# EAGLE design TSOC_Block_Template_SMD (EAGLE 6.6.0)
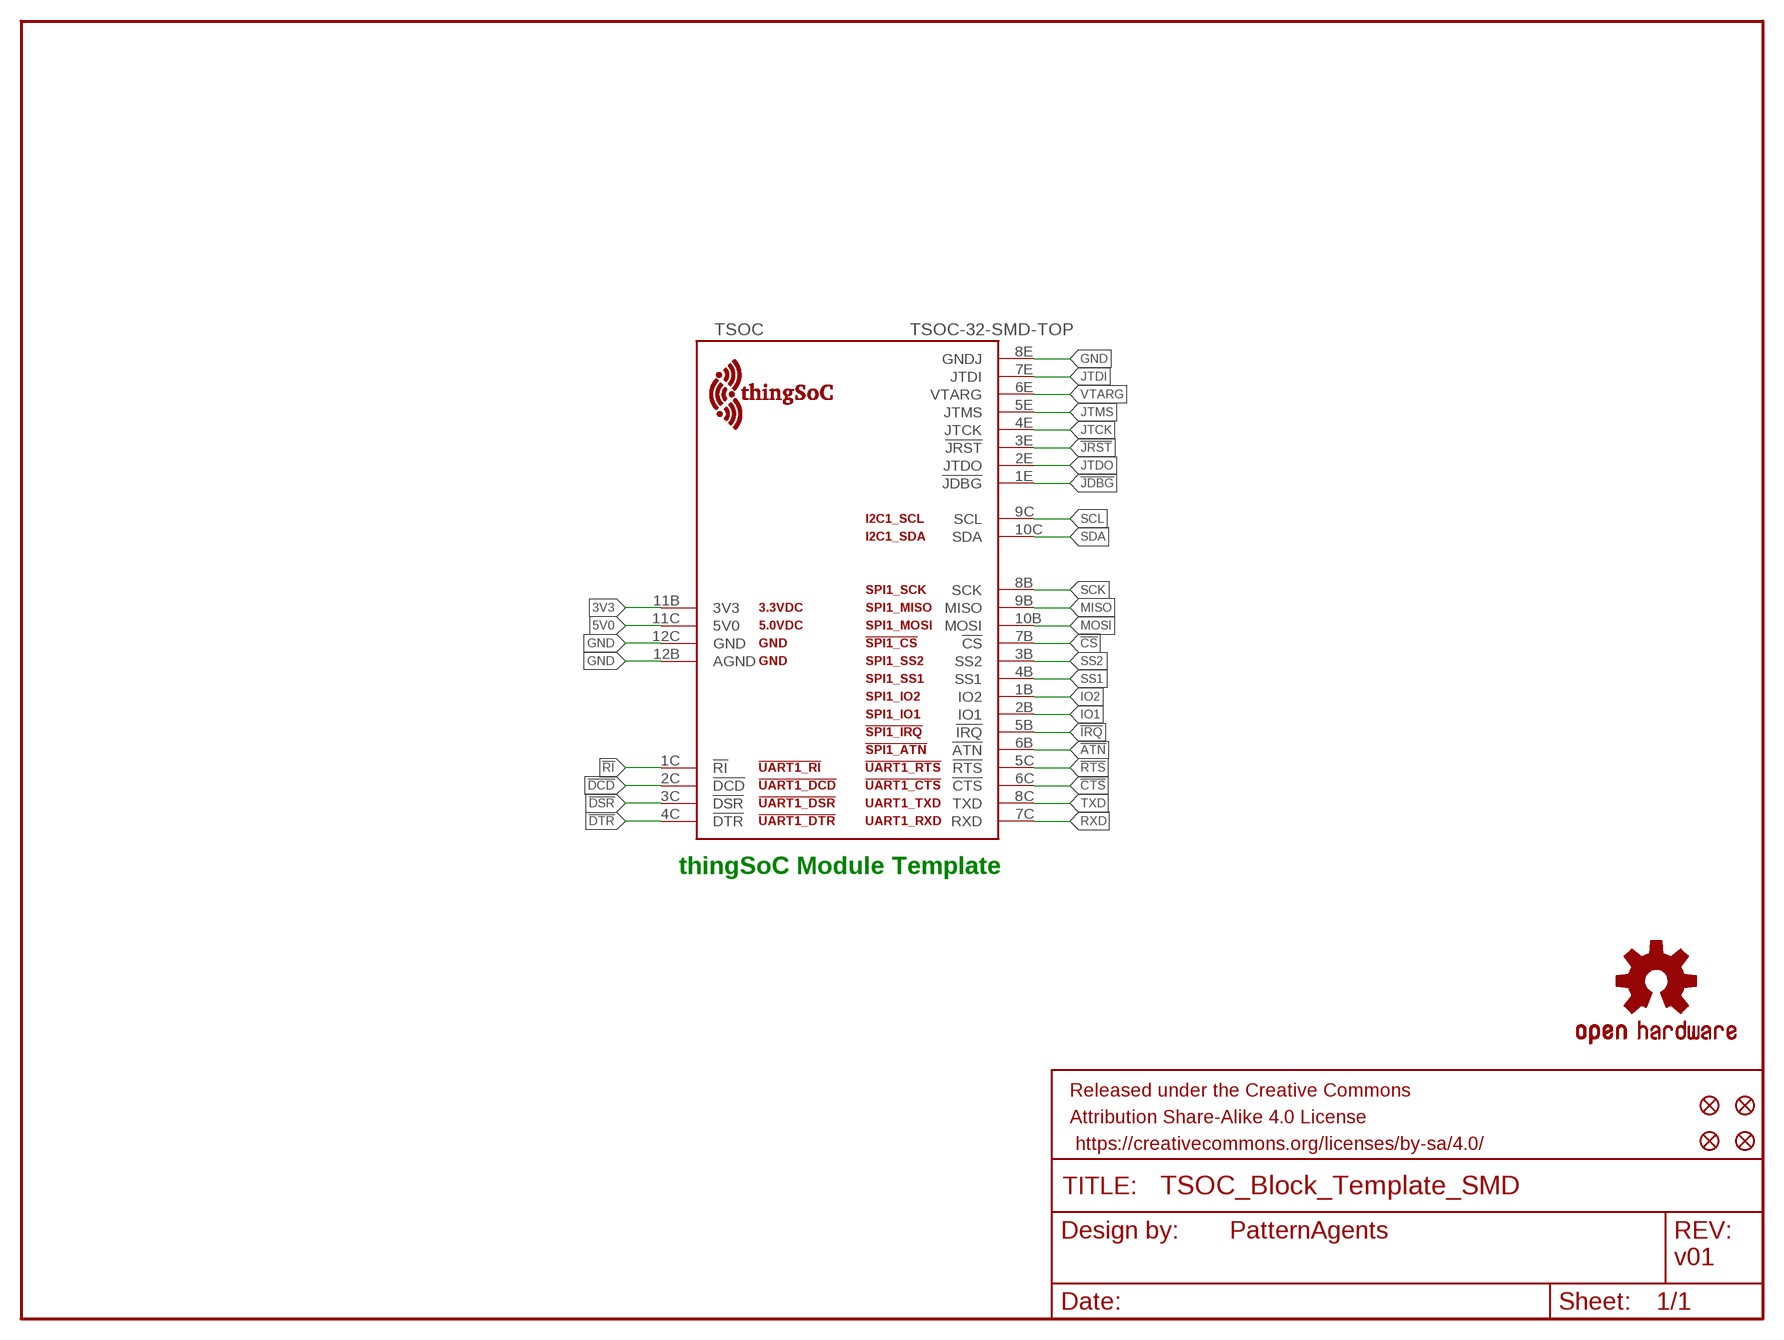
[diagram p0: schematic, sheet 1]

## Parts
FID1  FIDUCIAL1X2  [FIDUCIAL-1X2]
FID2  FIDUCIAL1X2  [FIDUCIAL-1X2]
FID3  FIDUCIAL1X2  [FIDUCIAL-1X2]
FID4  FIDUCIAL1X2  [FIDUCIAL-1X2]
FRAME1  FRAME-LETTER  [CREATIVE_COMMONS]
LOGO1  OSHW-LOGOS  [OSHW-LOGO-S]
TSOC  TSOC-32-SMD-TOP  [TSOC-BB-S32-SMD-TOP]

## Nets
3V3: TSOC.11B(3V3)
5V0: TSOC.11C(5V0)
!ATN: TSOC.6B(!ATN)
!CS: TSOC.7B(!CS)
!CTS: TSOC.6C(!CTS)
!DCD: TSOC.2C(!DCD)
!DSR: TSOC.3C(!DSR)
!DTR: TSOC.4C(!DTR)
!IRQ: TSOC.5B(!IRQ)
!JDBG: TSOC.1E(!JDBG)
!JRST: TSOC.3E(!JRST)
!RI: TSOC.1C(!RI)
!RTS: TSOC.5C(!RTS)
GND [vcc]: TSOC.8E(GNDJ) TSOC.12B(AGND) TSOC.12C(GND)
IO1: TSOC.2B(IO1)
IO2: TSOC.1B(IO2)
JTCK: TSOC.4E(JTCK)
JTDI: TSOC.7E(JTDI)
JTDO: TSOC.2E(JTDO)
JTMS: TSOC.5E(JTMS)
MISO: TSOC.9B(MISO)
MOSI: TSOC.10B(MOSI)
RXD: TSOC.7C(RXD)
SCK: TSOC.8B(SCK)
SCL: TSOC.9C(SCL)
SDA: TSOC.10C(SDA)
SS1: TSOC.4B(SS1)
SS2: TSOC.3B(SS2)
TXD: TSOC.8C(TXD)
VTARG: TSOC.6E(VTARG)

## Notes on the sheet
- thingSoC Module Template
- PatternAgents
- v01

## Library data of the parts
FID1-FID4 = SparkFun-Aesthetics:FIDUCIAL: Fiducial Alignment Points Various fiducial points for machine vision alignment.
FRAME1 = SparkFun-Aesthetics:FRAME-LETTER: Schematic Frame Standard 8.5x11 US Letter frame
LOGO1 = SparkFun-Aesthetics:OSHW-LOGO: Open Source Hardware Logo This logo indicates the piece of hardware it is found on incorporates a OSHW license and/or adheres to the definition of open source hardware found here: http://freedomdefined.org/OSHW
TSOC = thingSoC:TSOC-32: thingSoC Thirty-Two (32) Pin Socket Source LBR : http://www.thingsoc.com Github : https://github.com/thingsoc License : http://creativecommons.org/licenses/by-sa/4.0/ (Creative Commons 4.0) THIS SOFTWARE IS PROVIDED BY THE CONTRIBUTORS "AS IS" AND WITHOUT ANY EXPRESS OR IMPLIED WARRANTIES, INCLUDING, BUT NOT LIMITED TO, THE IMPLIED WARRANTIES OF MERCHANTABILITY AND FITNESS FOR A PARTICULAR PURPOSE ARE DISCLAIMED. IN NO EVENT SHALL THE COPYRIGHT OWNER OR CONTRIBUTORS BE LIABLE FOR ANY DIRECT, INDIRECT, INCIDENTAL, SPECIAL, EXEMPLARY, OR CONSEQUENTIAL DAMAGES (INCLUDING, BUT NOT LIMITED TO, PROCUREMENT OF SUBSTITUTE GOODS OR SERVICES; LOSS OF USE, DATA, OR PROFITS; OR BUSINESS INTERRUPTION) HOWEVER CAUSED AND ON ANY THEORY OF LIABILITY, WHETHER IN CONTRACT, STRICT LIABILITY, OR TORT (INCLUDING NEGLIGENCE OR OTHERWISE) ARISING IN ANY WAY OUT OF THE USE OF THIS SOFTWARE, EVEN IF ADVISED OF THE POSSIBILITY OF SUCH DAMAGE.

## Net classes
1 vcc: width 0.254 mm

## Board
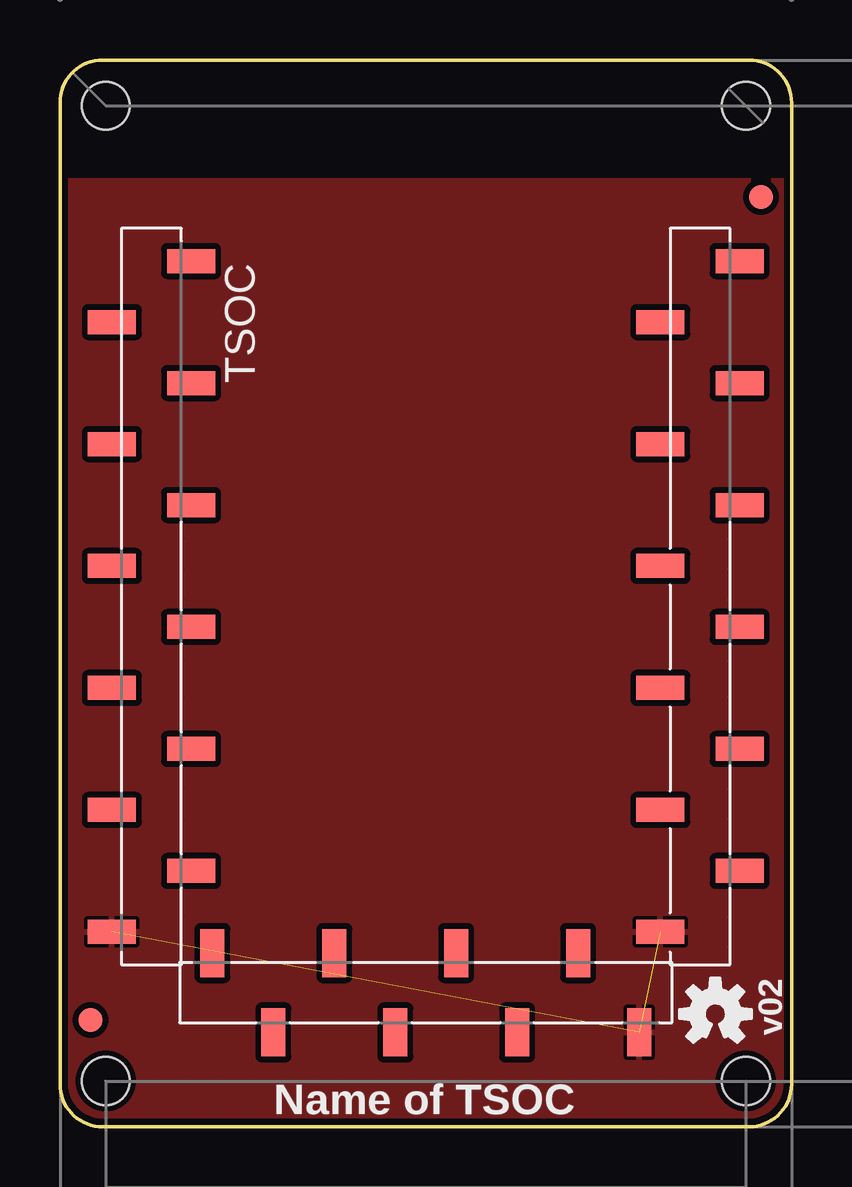
[diagram p1: board, top side]
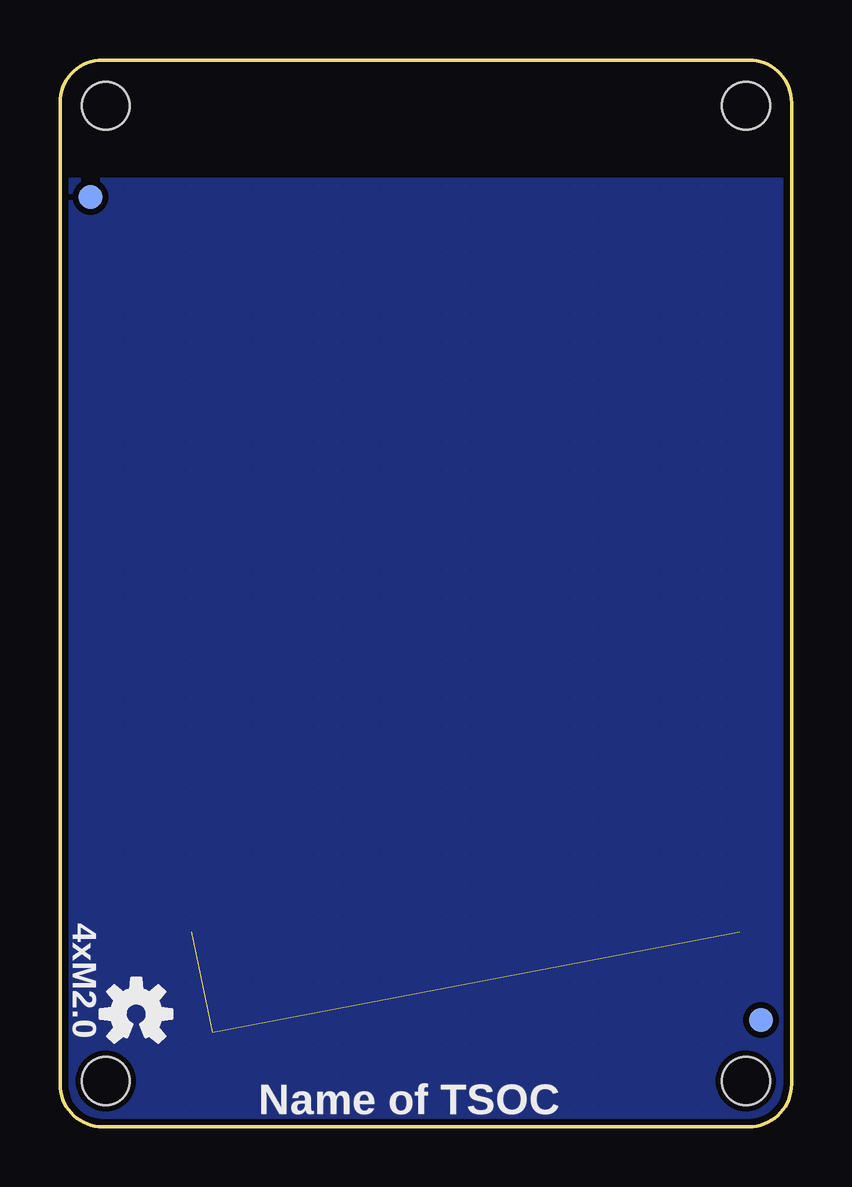
[diagram p2: board, bottom side, seen from below]

Size 30.48 x 44.45 mm. Coordinates in mm from the lower left corner, seen from the top.
Outline: 30.48,42.67 30.48,1.78 arc-90 28.7,0 1.78,0 arc-90 0,1.78 0,42.67 arc-90 1.78,44.45 28.7,44.45 arc-90 30.48,42.67
Copper layers (1*16): Top 0.035mm / dielectric 1.5mm / Bottom 0.035mm
Design rules "SparkFun-2-layer *": minimum track width 6mil, minimum drill 13mil, track to track 6mil, track to pad 6mil, pad to pad 6mil, via to via 6mil, smd to smd 6mil, copper to edge 8mil, drill to drill 8mil, minimum pad ring 12mil, minimum via ring 10mil, stop-mask expansion 4mil, vias tented up to drill 20mil, thermal gap 6mil
Holes 2 mm at 28.57,1.91 1.91,1.91 1.91,42.55 28.57,42.55
tRestrict: area 0,40 to 30.5,44.3
bRestrict: area 0,40 to 30.5,44.3

### Footprints (pad centres in the part's own frame; a part is rotated, then mirrored left to right if it is on the bottom)
FIDUCIAL-1X2 = smd 1 x 1: 1 0,0
TSOC-BB-S32-SMD-TOP = smd 1 x 2: 1B -11.43,-9.78; 1C -11.43,13.08; 2B -8.89,-13.08; 2C -8.89,9.78; 3B -6.35,-9.78; 3C -6.35,13.08; 4B -3.81,-13.08; 4C -3.81,9.78; 5B -1.27,-9.78; 5C -1.27,13.08; 6B 1.27,-13.08; 6C 1.27,9.78; 7B 3.81,-9.78; 7C 3.81,13.08; 8B 6.35,-13.08; 8C 6.35,9.78; 9B 8.89,-9.78; 9C 8.89,13.08; 10B 11.43,-13.08; 10C 11.43,9.78; 11B 13.97,-9.78; 11C 13.97,13.08; 12B 16.51,-13.08; 12C 16.51,9.78 | smd 2 x 1: 1E 17.4,-8.89; 2E 20.7,-6.35; 3E 17.4,-3.81; 4E 20.7,-1.27; 5E 17.4,1.27; 6E 20.7,3.81; 7E 17.4,6.35; 8E 20.7,8.89

### Placement (x,y rotation side)
FID1  1.27,4.45 0 top
FID2  29.21,38.73 0 top
FID3  1.27,4.45 0 bottom
FID4  29.21,38.73 0 bottom
FRAME1  0.76,-13.97 0 top  (outside the outline)
LOGO1  27.3,4.7 0 top
LOGO2  OSHW-LOGOS  [OSHW-LOGO-S]  27.3,4.7 0 bottom
TSOC  15.24,24.64 270 top

### Tracks (layer width: path | path; a pad name or v marks a point on that pad's centre or on a via)
GND  (2 unrouted)
  pour Bottom (isolate 0.254, rank 6, hatched): 30.48,42.67 30.48,1.78 arc-90 28.7,0 1.78,0 arc-90 0,1.78 0,42.67 arc-90 1.78,44.45 28.7,44.45 arc-90
  pour Top (isolate 0.254, rank 6, hatched): 30.48,1.78 arc-90 28.75,0 1.78,0 arc-90 0,1.78 0,42.67 arc-90 1.78,44.45 28.7,44.45 arc-90 30.48,42.67

### Text on the board
tPlace: v02 | Name of TSOC
bPlace: 4xM2.0 | Name of TSOC
tDocu: Max Board Length | User Interface/Connectors / RF/Antenna Safe Area | Note: Units are in Inches | PatternAgents